# EasyEDA schematic 1-Schematic_MiniX.json
TITLE: New Schematic; REV: 1.0; Date: 2018-06-02; Sheet: 1/1; Drawn By: val2017
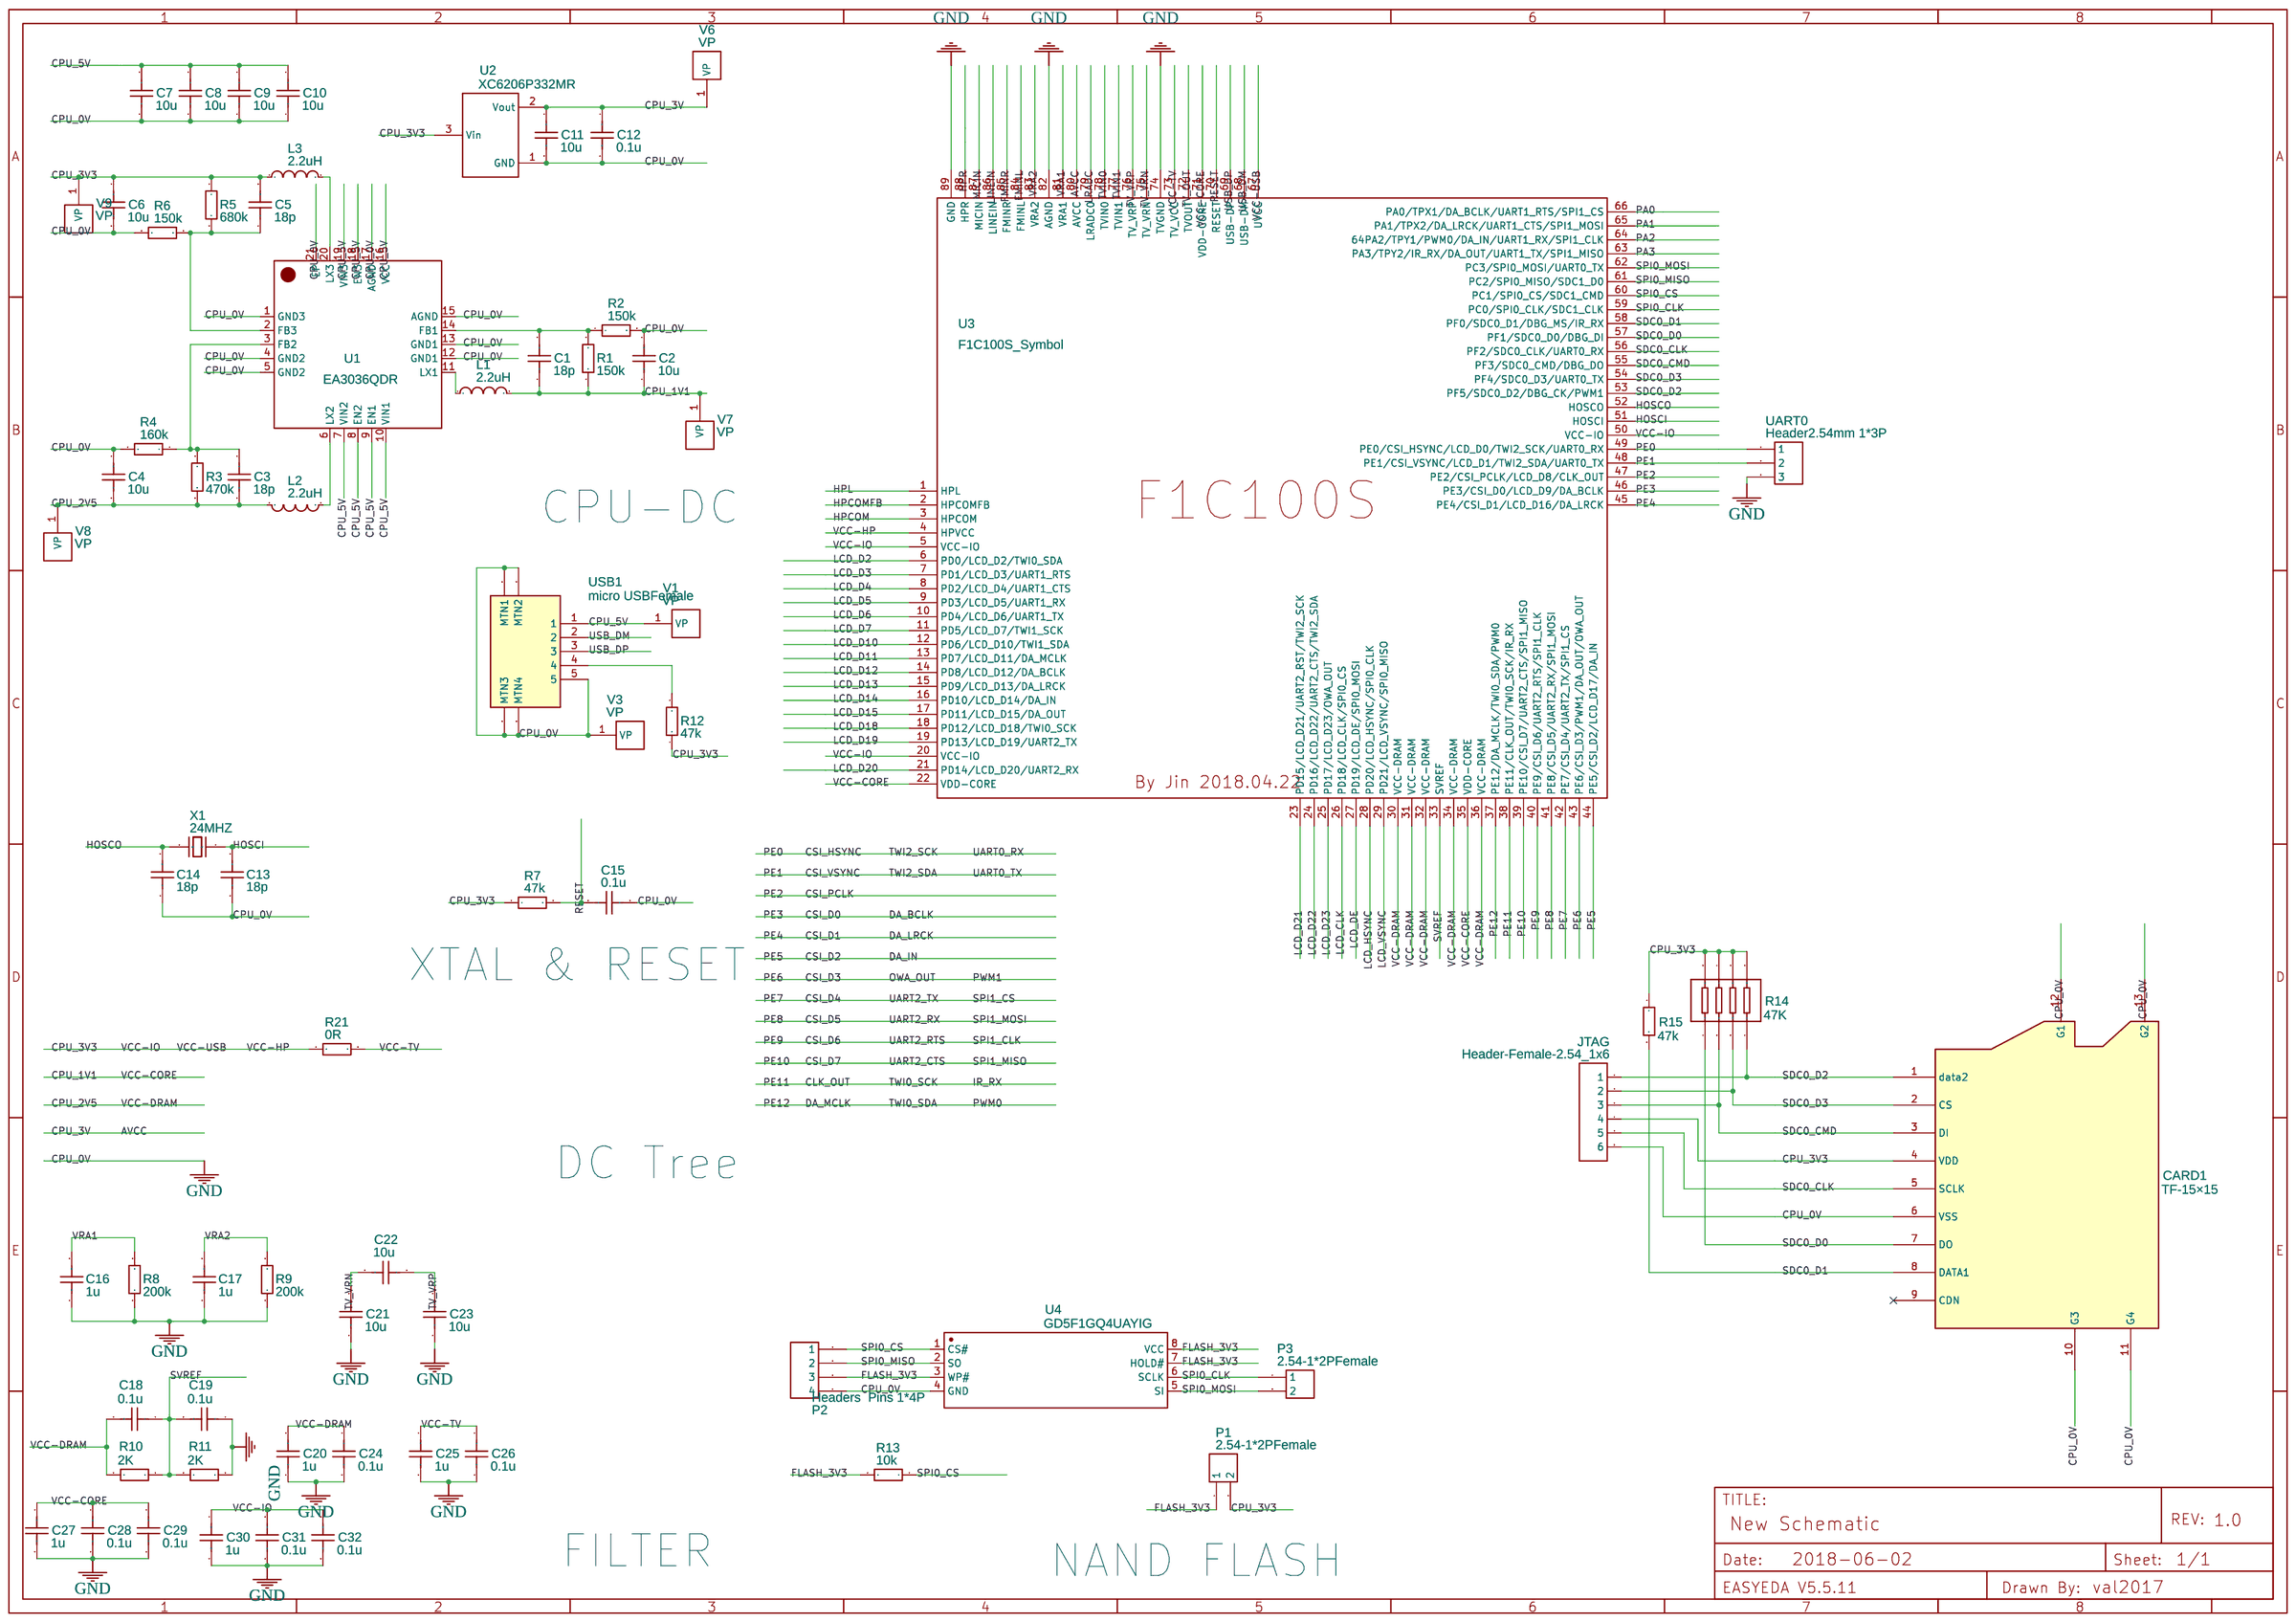
[diagram p0: schematic sheet]

## Parts
C1  18p  [0603]
C2  10u  [0603]
C3  18p  [0603]
C4  10u  [0603]
C5  18p  [0603]
C6  10u  [0603]
C7  10u  [0603]
C8  10u  [0603]
C9  10u  [0603]
C10  10u  [0603]
C11  10u  [0603]
C12  0.1u  [0603]
C13  18p  [0603]
C14  18p  [0603]
C15  0.1u  [0603]
C16  1u  [0603]
C17  1u  [0603]
C18  0.1u  [0603]
C19  0.1u  [0603]
C20  1u  [0603]
C21  10u  [0603]
C22  10u  [0603]
C23  10u  [0603]
C24  0.1u  [0603]
C25  1u  [0603]
C26  0.1u  [0603]
C27  1u  [0603]
C28  0.1u  [0603]
C29  0.1u  [0603]
C30  1u  [0603]
C31  0.1u  [0603]
C32  0.1u  [0603]
CARD1  TF-15×15  [SD-MICRO-1]
JTAG  Header-Female-2.54_1x6  [HDR-6X1/2.54]
L1  2.2uH  [0420贴片电感]
L2  2.2uH  [0420贴片电感]
L3  2.2uH  [0420贴片电感]
P1  2.54-1*2PFemale  [HDR-1X2/2.54]
P2  Headers  Pins 1*4P  [HDR-4X1/2.54]
P3  2.54-1*2PFemale  [HDR-1X2/2.54]
R1  150k  [0603]
R2  150k  [0603]
R3  470k  [0603]
R4  160k  [0805]
R5  680k  [0603]
R6  150k  [0603]
R7  47k  [0603]
R8  200k  [0603]
R9  200k  [0603]
R10  2K  [0603]
R11  2K  [0603]
R12  47k  [0603]
R13  10k  [0603]
R14  47K  [0402_X4]
R15  47k  [0603]
R21  0R  [0603]
U1  EA3036QDR  [QFN-20-EP]
U2  XC6206P332MR  [SOT-23(SOT-23-3)]
U3  F1C100S_Symbol  [C100SQFN-88_10.0X10.0XP04MM]
U4  GD5F1GQ4UAYIG  [WSON-8_8.0X6.0XP1.27]
UART0  Header2.54mm 1*3P  [HDR-3X1/2.54]
USB1  micro USBFemale  [MICRO-USB-1]
V1  VP  [VP-5V]
V3  VP  [VP-0V]
V6  VP  [VP-3V]
V7  VP  [VP-1V1]
V8  VP  [VP-2V5]
V9  VP  [VP-3V3]
X1  24MHZ  [3225]

## Library data of the parts
C1-C32 = Cap_RAD-0.1_US: Manufacturer Part: ?
CARD1 = -: Supplier: LCSC; Manufacturer: SOFNG; Supplier Part: C111196
JTAG = -: Supplier Part: C40877; Supplier: LCSC; Manufacturer: BOOMELE; Manufacturer Part: Female header 1*6p
L1-L3 = Inductor: Manufacturer Part: ?
P1 P3 = -: Supplier: LCSC; Manufacturer: BOOMELE; image: http://image.lceda.cn/szlcsc/C49661.jpg; Supplier Part: C49661
P2 = -: Supplier: LCSC; Manufacturer: ReliaPro; image: http://image.lceda.cn/szlcsc/C59481.jpg; Supplier Part: undefined
R1-R13 R15 R21 = Resistor: Manufacturer Part: ?
R14 = -: Supplier: LCSC; Manufacturer Part: 4D02WGJ0472TCE; Supplier Part: undefined
U1 = -: Manufacturer: Everanalog; Supplier: LCSC; Supplier Part: C111587
U2 = -: Supplier: LCSC; Manufacturer: TOREX; LCSC Assembly: Yes; image: //image.lceda.cn/szlcsc/C5446.jpg; Supplier Part: C5446
U3 = F1C100S_Symbol: catid: 20; Contributor: val2017; Manufacturer Part: ?
U4 = -: Supplier: LCSC; Manufacturer: Micronix; Manufacturer Part: MX25L12835FM2I-10G; Supplier Part: C71945
UART0 = -: Supplier: LCSC; Manufacturer: BOOMELE; image: http://image.lceda.cn/szlcsc/C49257.jpg; Supplier Part: C49257
USB1 = -: Supplier: LCSC; Manufacturer: ValuePro; image: //image.lceda.cn/szlcsc/C10418.jpg; Supplier Part: C10418
V1 V3 V6-V9 = VP: catid: 20; Contributor: val2017; Manufacturer Part: ?
X1 = -: Supplier: LCSC; Manufacturer: LCSC; Manufacturer Part: X49SD12MSD2SC; Supplier Part: undefined

## Nets
AVCC: C11.1 C12.1 U2.2(Vout) U3.80(AVCC) V6.1(VP)
VCC-TV: C25.1 C26.1 R21.2 U3.73(TV_VCC)
CLK_OUT: U3.38(PE11/CLK_OUT/TWI0_SCK/IR_RX)
CPU_0V: C2.2 C4.1 C6.2 C7.1 C8.1 C9.1 C10.1 C11.2 C12.2 C13.1 C14.1 C15.1 C16.1 C17.1 C19.1 C20.2 C21.2 C23.2 C24.2 C25.2 C26.2 C27.2 C28.2 C29.2 C30.2 C31.2 C32.2 CARD1.6(VSS) CARD1.10(G3) CARD1.11(G4) CARD1.12(G1) CARD1.13(G2) JTAG.6 P2.4 R2.2 R4.2 R6.2 R8.1 R9.1 R11.1 U1.1(GND3) U1.4(GND2) U1.5(GND2) U1.12(GND1) U1.13(GND1) U1.15(AGND) U1.17(AGND) U1.21(EP) U2.1(GND) U3.74(TVGND) U3.82(AGND) U3.89(GND) U4.4(GND) UART0.3 USB1.0(MTN1) USB1.5 V3.1(VP)
CPU_1V1: C1.1 C2.1 C27.1 C28.1 C29.1 L1.2 R1.1 U3.22(VDD-CORE) U3.35(VDD-CORE) U3.71(VDD-CORE) V7.1(VP)
CPU_2V5: C3.2 C4.2 C18.2 C20.1 C24.1 L2.2 R3.2 R10.2 U3.30(VCC-DRAM) U3.31(VCC-DRAM) U3.32(VCC-DRAM) U3.34(VCC-DRAM) U3.36(VCC-DRAM) V8.1(VP)
CPU_3V3: C5.2 C6.1 C30.1 C31.1 C32.1 CARD1.4(VDD) JTAG.4 L3.1 P1.2 R5.1 R7.1 R12.1 R14.5 R14.6 R14.7 R14.8 R15.1 R21.1 U2.3(Vin) U3.4(HPVCC) U3.5(VCC-IO) U3.20(VCC-IO) U3.50(VCC-IO) U3.67(UVCC) V9.1(VP)
CPU_5V: C7.2 C8.2 C9.2 C10.2 U1.7(VIN2) U1.8(EN2) U1.9(EN1) U1.10(VIN1) U1.16(VCC) U1.18(EN3) U1.19(VIN3) USB1.1 V1.1(VP)
CSI_D0: U3.46(PE3/CSI_D0/LCD_D9/DA_BCLK)
CSI_D1: U3.45(PE4/CSI_D1/LCD_D16/DA_LRCK)
CSI_D2: U3.44(PE5/CSI_D2/LCD_D17/DA_IN)
CSI_D3: U3.43(PE6/CSI_D3/PWM1/DA_OUT/OWA_OUT)
CSI_D4: U3.42(PE7/CSI_D4/UART2_TX/SPI1_CS)
CSI_D5: U3.41(PE8/CSI_D5/UART2_RX/SPI1_MOSI)
CSI_D6: U3.40(PE9/CSI_D6/UART2_RTS/SPI1_CLK)
CSI_D7: U3.39(PE10/CSI_D7/UART2_CTS/SPI1_MISO)
CSI_HSYNC: U3.49(PE0/CSI_HSYNC/LCD_D0/TWI2_SCK/UART0_RX) UART0.1
CSI_PCLK: U3.47(PE2/CSI_PCLK/LCD_D8/CLK_OUT)
CSI_VSYNC: U3.48(PE1/CSI_VSYNC/LCD_D1/TWI2_SDA/UART0_TX) UART0.2
DA_MCLK: U3.37(PE12/DA_MCLK/TWI0_SDA/PWM0)
FLASH_3V3: P1.1 P2.3 R13.2 U4.3(WP#) U4.7(HOLD#) U4.8(VCC)
FMINL: U3.84(FMINL)
FMINR: U3.85(FMINR)
HOSCI: C13.2 U3.51(HOSCI) X1.1(OSC1)
HOSCO: C14.2 U3.52(HOSCO) X1.2(OSC2)
HPCOM: U3.3(HPCOM)
HPCOMFB: U3.2(HPCOMFB)
HPL: U3.1(HPL)
HPR: U3.88(HPR)
LCD_CLK: U3.26(PD18/LCD_CLK/SPI0_CS)
LCD_D2: U3.6(PD0/LCD_D2/TWI0_SDA)
LCD_D3: U3.7(PD1/LCD_D3/UART1_RTS)
LCD_D4: U3.8(PD2/LCD_D4/UART1_CTS)
LCD_D5: U3.9(PD3/LCD_D5/UART1_RX)
LCD_D6: U3.10(PD4/LCD_D6/UART1_TX)
LCD_D7: U3.11(PD5/LCD_D7/TWI1_SCK)
LCD_D10: U3.12(PD6/LCD_D10/TWI1_SDA)
LCD_D11: U3.13(PD7/LCD_D11/DA_MCLK)
LCD_D12: U3.14(PD8/LCD_D12/DA_BCLK)
LCD_D13: U3.15(PD9/LCD_D13/DA_LRCK)
LCD_D14: U3.16(PD10/LCD_D14/DA_IN)
LCD_D15: U3.17(PD11/LCD_D15/DA_OUT)
LCD_D18: U3.18(PD12/LCD_D18/TWI0_SCK)
LCD_D19: U3.19(PD13/LCD_D19/UART2_TX)
LCD_D20: U3.21(PD14/LCD_D20/UART2_RX)
LCD_D21: U3.23(PD15/LCD_D21/UART2_RST/TWI2_SCK)
LCD_D22: U3.24(PD16/LCD_D22/UART2_CTS/TWI2_SDA)
LCD_D23: U3.25(PD17/LCD_D23/OWA_OUT)
LCD_DE: U3.27(PD19/LCD_DE/SPI0_MOSI)
LCD_HSYNC: U3.28(PD20/LCD_HSYNC/SPI0_CLK)
LCD_VSYNC: U3.29(PD21/LCD_VSYNC/SPI0_MISO)
LINEIN: U3.86(LINEIN)
LRADC: U3.79(LRADC0)
MICIN: U3.87(MICIN)
PA0: U3.66(PA0/TPX1/DA_BCLK/UART1_RTS/SPI1_CS)
PA1: U3.65(PA1/TPX2/DA_LRCK/UART1_CTS/SPI1_MOSI)
PA2: U3.64(64PA2/TPY1/PWM0/DA_IN/UART1_RX/SPI1_CLK)
PA3: U3.63(PA3/TPY2/IR_RX/DA_OUT/UART1_TX/SPI1_MISO)
RESET: C15.2 R7.2 U3.70(RESET)
SDC0_CLK: CARD1.5(SCLK) JTAG.5 U3.56(PF2/SDC0_CLK/UART0_RX)
SDC0_CMD: CARD1.3(DI) JTAG.3 R14.2 U3.55(PF3/SDC0_CMD/DBG_DO)
SDC0_D0: CARD1.7(DO) R14.1 U3.57(PF1/SDC0_D0/DBG_DI)
SDC0_D1: CARD1.8(DATA1) R15.2 U3.58(PF0/SDC0_D1/DBG_MS/IR_RX)
SDC0_D2: CARD1.1(data2) JTAG.1 R14.4 U3.53(PF5/SDC0_D2/DBG_CK/PWM1)
SDC0_D3: CARD1.2(CS) JTAG.2 R14.3 U3.54(PF4/SDC0_D3/UART0_TX)
SPI0_CLK: P3.1 U3.59(PC0/SPI0_CLK/SDC1_CLK) U4.6(SCLK)
SPI0_CS: P2.1 R13.1 U3.60(PC1/SPI0_CS/SDC1_CMD) U4.1(CS#)
SPI0_MISO: P2.2 U3.61(PC2/SPI0_MISO/SDC1_D0) U4.2(SO)
SPI0_MOSI: P3.2 U3.62(PC3/SPI0_MOSI/UART0_TX) U4.5(SI)
SVREF: C18.1 C19.2 R10.1 R11.2 U3.33(SVREF)
TV_OUT: U3.72(TVOUT)
TV_VRN: C21.1 C22.2 U3.75(TV_VRN)
TV_VRP: C22.1 C23.1 U3.76(TV_VRP)
TVIN0: U3.78(TVIN0)
TVIN1: U3.77(TVIN1)
USB_DM: U3.68(USB-DM) USB1.2
USB_DP: U3.69(USB-DP) USB1.3
VRA1: C16.2 R8.2 U3.81(VRA1)
VRA2: C17.2 R9.2 U3.83(VRA2)
U1_2: C5.1 R5.2 R6.1 U1.2(FB3)
U1_3: C3.1 R3.1 R4.1 U1.3(FB2)
U1_6: L2.1 U1.6(LX2)
U1_11: L1.1 U1.11(LX1)
U1_14: C1.2 R1.2 R2.1 U1.14(FB1)
U1_20: L3.2 U1.20(LX3)
USB1_4: R12.2 USB1.4

Not connected (* = marked no-connect by the designer): CARD1 9(CDN)*

## Notes on the sheet
- CPU-DC
- XTAL & RESET
- DC Tree
- FILTER
- NAND FLASH
